# Altium schematic sheet Sheet1.SchDoc
size A4; SheetNumber: 1; SheetTotal: 1
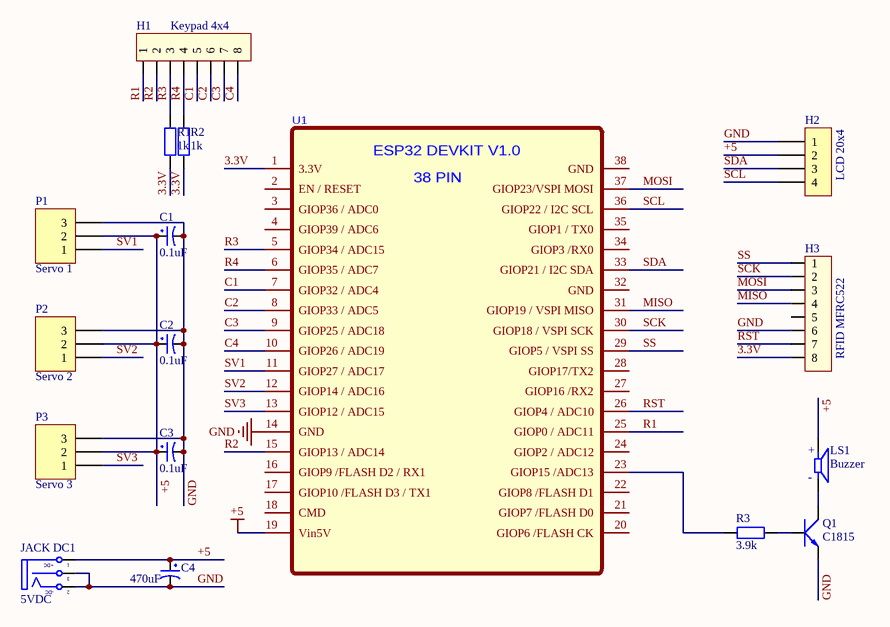
[diagram p0: Sheet1.SchDoc]

## Parts
C1  0.1uF  [tu hoa 5mm]
C2  0.1uF  [tu hoa 5mm]
C3  0.1uF  [tu hoa 5mm]
C4  470uF  [tu hoa 10mm]
H1  Keypad 4x4  [XH2.54M-8]
H2  LCD 20x4  [XH2.54M-4]
H3  RFID MFRC522  [XH2.54M-8]
JACK_DC1  5VDC  [JACK DC 5.5]
LS1  Buzzer  [Buzzer-9MM]
P1  Servo 1  [HDR1X3]
P2  Servo 2  [HDR1X3]
P3  Servo 3  [HDR1X3]
Q1  C1815  [TO92]
R1  1k  [tro vach 1/4w]
R2  1k  [tro vach 1/4w]
R3  3.9k  [tro vach 1/4w]
U1  ESP32-DEVKI-V1.0-PIN38  [ESP32-DEVKIT-V1.0-38PIN]  (value not drawn)

## Nets
+5: C1.1 C2.1 C3.1 C4.1 H2.2 JACK_DC1.1(T) LS1.1(P) P1.2 P2.2 P3.2 U1.19(Vin5V)
GND: C1.2 C2.2 C3.2 C4.2 H2.1 H3.6 JACK_DC1.2(TN) JACK_DC1.3(S) P1.3 P2.3 P3.3 Q1.1(E) U1.14(GND)
3.3V: H3.8 R1.1 R2.1 U1.1(3.3V)
C1: H1.5 U1.7(GIOP32_/_ADC4)
C2: H1.6 U1.8(GIOP33_/_ADC5)
C3: H1.7 U1.9(GIOP25_/_ADC18)
C4: H1.8 U1.10(GIOP26_/_ADC19)
MISO: H3.4 U1.31(GIOP19_/_VSPI_MISO)
MOSI: H3.3 U1.37(GIOP23/VSPI_MOSI)
R1: H1.1 U1.25(GIOP0_/_ADC11)
R2: H1.2 U1.15(GIOP13_/_ADC14)
R3: H1.3 R1.2 U1.5(GIOP34_/_ADC15)
R4: H1.4 R2.2 U1.6(GIOP35_/_ADC7)
RST: H3.7 U1.26(GIOP4_/_ADC10)
SCK: H3.2 U1.30(GIOP18_/_VSPI_SCK)
SCL: H2.4 U1.36(GIOP22_/_I2C_SCL)
SDA: H2.3 U1.33(GIOP21_/_I2C_SDA)
SS: H3.1 U1.29(GIOP5_/_VSPI_SS)
SV1: P1.1 U1.11(GIOP27_/_ADC17)
SV2: P2.1 U1.12(GIOP14_/_ADC16)
SV3: P3.1 U1.13(GIOP12_/_ADC15)
NetLS1_2: LS1.2(M) Q1.2(C)
NetQ1_3: Q1.3(B) R3.2
NetR3_1: R3.1 U1.23(GIOP15_/ADC13)

Not connected (* = marked no-connect by the designer): H3 5; U1 2(EN_/_RESET) 3(GIOP36_/_ADC0) 4(GIOP39_/_ADC6) 16(GIOP9_/FLASH_D2_/_RX1) 17(GIOP10_/FLASH_D3_/_TX1) 18(CMD) 20(GIOP6_/FLASH_CK) 21(GIOP7_/FLASH_D0) 22(GIOP8_/FLASH_D1) 24(GIOP2_/_ADC12) 27(GIOP16_/RX2) 28(GIOP17/TX2) 32(GND) 34(GIOP3_/RX0) 35(GIOP1_/_TX0) 38(GND)

## Notes on the sheet
- (in symbol Buzzer) +; -
- (in symbol ESP32-DEVKI-V1.0-PIN38) ESP32 DEVKIT V1.0; 38 PIN
- (in symbol JACK DC 5.5) +DC; -DC

## Library data of the parts
C1-C3 = Tu Hoa 0.1uF 50V 5x11: Cắm; Don_Vi: Con; So_Chan: 2; Ten_Linh_Kien: Tụ Hóa 0.1uF 50V; Ma_Hang: MH006853; Chung_Loai: Cắm; Kieu_Chan: *
C4 = Tu Hoa 470uF 50V 10x17: Cắm; Don_Vi: Con; So_Chan: 2; Ten_Linh_Kien: Tụ Hóa 470uF 50V; Ma_Hang: MH006866; Chung_Loai: Cắm; Kieu_Chan: *
H1 H3 = Header 8P 2.54 Duc Thang: Cắm; Ten_Linh_Kien: Header 8P XH2.54-8P Đực Thẳng; Don_Vi: Con; Ma_Hang: MH003366; Chung_Loai: Cắm
H2 = Header 4P 2.54 Duc Thang: Cắm; Ten_Linh_Kien: Header 4P XH2.54-4P Đực Thẳng; Don_Vi: Con; Ma_Hang: MH001285; Chung_Loai: Cắm
JACK_DC1 = JACK DC 5.5: Value: Jac DC
LS1 = Buzzer: MP: CST-951AP; Availability: Unavailable; Price: None; Value: *; Package: None
P1-P3 = Header 3: Header, 3-Pin; LatestRevisionDate: 17-Jul-2002; LatestRevisionNote: Re-released for DXP Platform.; Publisher: Altium Limited
Q1 = Trans C1815 DIP: NPN transistor; Value: C9014
R1 R2 = Tro Vach 1/4W 5% 1k: Cắm; Don_Vi: Con; So_Chan: 2; Ten_Linh_Kien: Trở Vạch 1/4w 5% 1k; Ma_Hang: MH007390; Chung_Loai: Cắm; Kieu_Chan: *
R3 = Tro Vach 1/4W 5% 3.9k: Cắm; Don_Vi: Con; So_Chan: 2; Ten_Linh_Kien: Trở Vạch 1/4w 5% 3.9K; Ma_Hang: MH007307; Chung_Loai: Cắm; Kieu_Chan: *